# Altium schematic sheet Filter2.SchDoc
size A; SheetNumber: 3; SheetTotal: 3
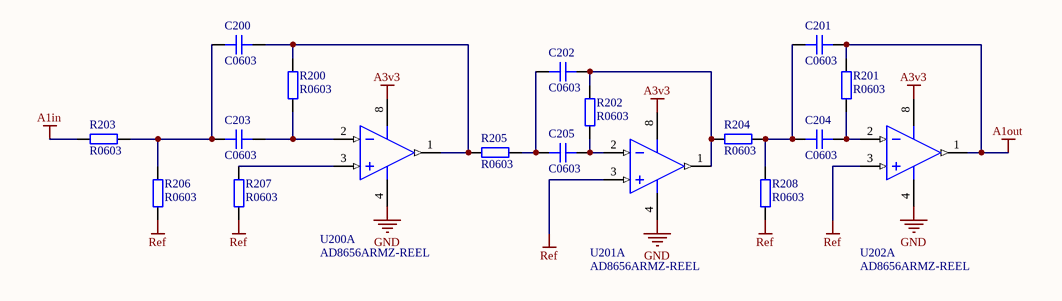
[diagram p0: Filter2.SchDoc]

## Parts
C200  C0603  [CAP_0603]
C201  C0603  [CAP_0603]
C202  C0603  [CAP_0603]
C203  C0603  [CAP_0603]
C204  C0603  [CAP_0603]
C205  C0603  [CAP_0603]
R200  R0603  [RES_0603]
R201  R0603  [RES_0603]
R202  R0603  [RES_0603]
R203  R0603  [RES_0603]
R204  R0603  [RES_0603]
R205  R0603  [RES_0603]
R206  R0603  [RES_0603]
R207  R0603  [RES_0603]
R208  R0603  [RES_0603]
U200  AD8656ARMZ-REEL  [ADI-RM-8_N]  (part A of 2)
U201  AD8656ARMZ-REEL  [ADI-RM-8_N]  (part A of 2)
U202  AD8656ARMZ-REEL  [ADI-RM-8_N]  (part A of 2)

## Nets
A1in: R203.2
A1out: C201.2 R201.2 U202.1(OUT_A)
A3v3: U200.8(+V) U201.8(+V) U202.8(+V)
GND: U200.4(-V) U201.4(-V) U202.4(-V)
Ref: R206.2 R207.1 R208.1 U201.3(+IN_A) U202.3(+IN_A)
NetC200_1: C200.1 C203.1 R203.1 R206.1
NetC200_2: C200.2 R200.2 R205.2 U200.1(OUT_A)
NetC201_1: C201.1 C204.1 R204.1 R208.2
NetC202_1: C202.1 C205.1 R205.1
NetC202_2: C202.2 R202.2 R204.2 U201.1(OUT_A)
NetC203_2: C203.2 R200.1 U200.2(-IN_A)
NetC204_2: C204.2 R201.1 U202.2(-IN_A)
NetC205_2: C205.2 R202.1 U201.2(-IN_A)
NetR207_2: R207.2 U200.3(+IN_A)

## Library data of the parts
C200-C205 = CAP_0603: Capacitor SMD 0603; Manufacturer: *; Manufacturer Part Number: *; Distributor Link: *; LCSC: *; Rating: *; Dielectric: *
R200-R208 = RES_0603: Resistor SMD 0603; Manufacturer: *; Manufacturer Part Number: *; Distributor Link: *; LCSC: *
U200-U202 = CMP-0384-01673-1: Double Channel RRIO Operational Amplifier, 28 MHz BW, 11 V/us SR, Industrial, 8-pin SOP (RM-8), Reel; Generic Part Number: AD8656; Manufacturer: Analog Devices; Input Bias Current: 1pA; Automotive Qualified: Yes; V Span Min: 2.7V; Iq/Amp: 4.5mA; Slew Rate: 11V/us; Input Offset Voltage: 50uV; Small Signal Bandwidth: 28MHz; V Span Max: 5.5V; Amplifiers Per Package: 2; ComponentLink3Description: Package Specification; ComponentLink2Description: Datasheet; Mounting Technology: Surface Mount; Code_JEDEC: MO-187-AA; PackageReference: RM-8; ComponentLink2URL: http://www.analog.com/static/imported-files/data_sheets/AD8655_8656.pdf; DatasheetVersion: Rev. B; ComponentLink1URL: http://www.analog.com/en/index.html; PartNumber: AD8656ARMZ-REEL; ComponentLink1Description: Manufacturer URL; ComponentLink3URL: http://www.analog.com/static/imported-files/packages/PKG_PDF/MSOP%28RM%29/RM_8.pdf; PackageDescription: 8-Pin Mini Small Outline Package, Body 3 x 3 mm, Pitch 0.65 mm